# Altium schematic sheet 07_Analog Buffer.SchDoc
size A3; SheetNumber: 7; SheetTotal: 14
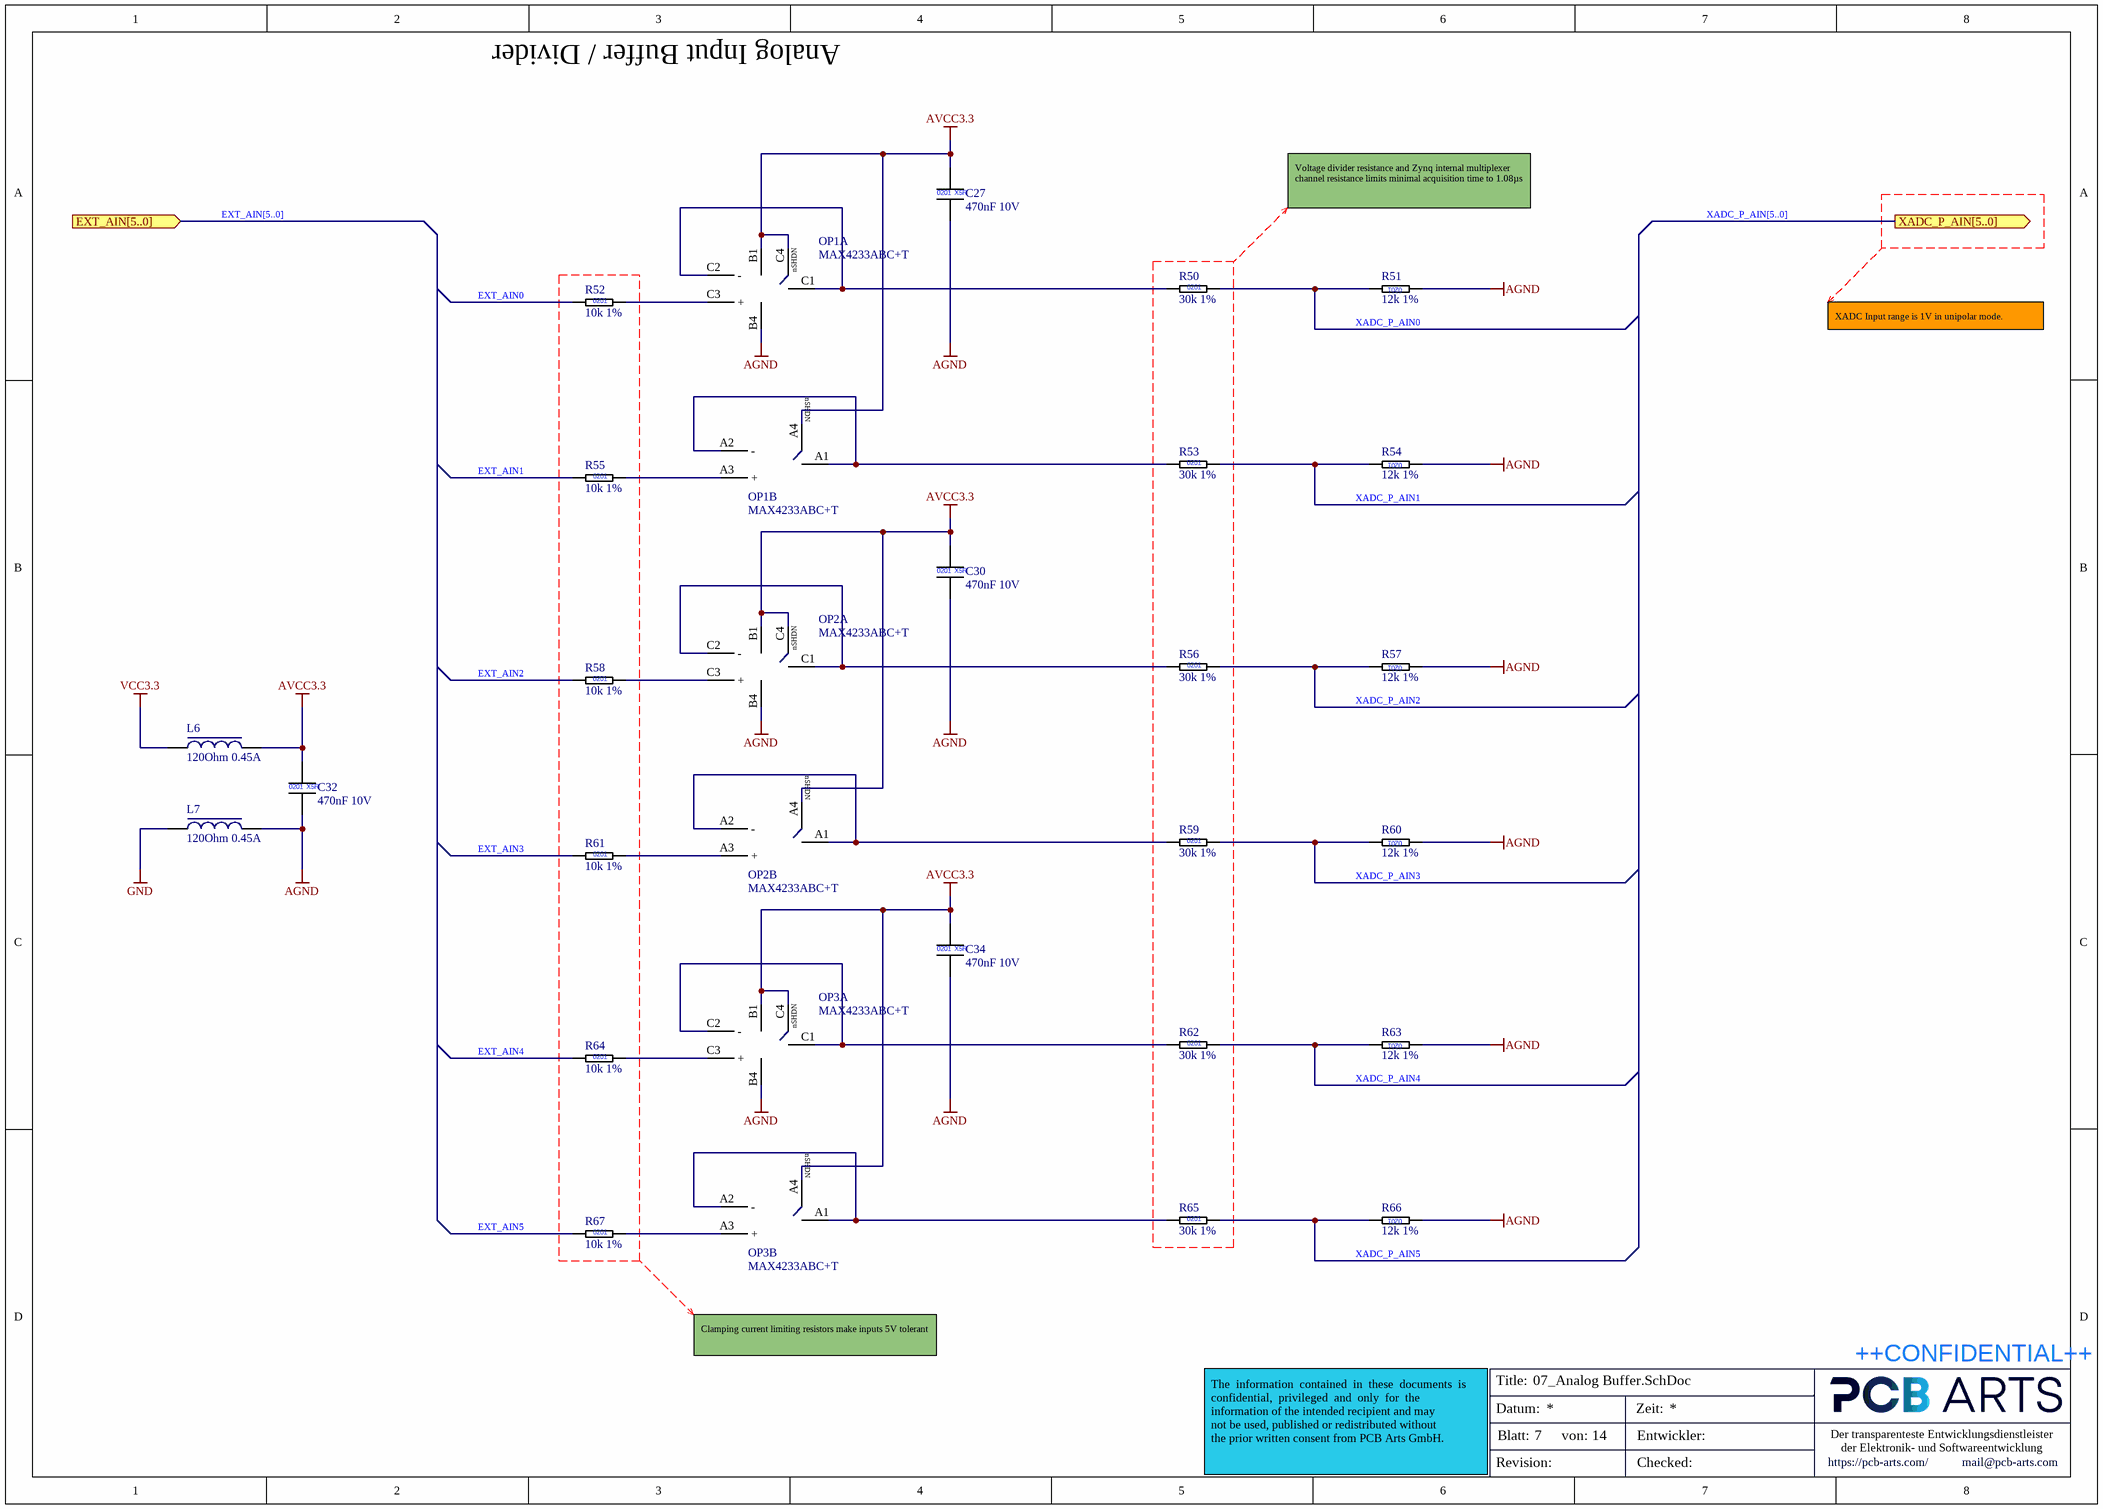
[diagram p0: 07_Analog Buffer.SchDoc]

## Parts
C27  470nF 10V  [CAPC0603X03L]
C30  470nF 10V  [CAPC0603X03L]
C32  470nF 10V  [CAPC0603X03L]
C34  470nF 10V  [CAPC0603X03L]
L6  120Ohm 0.45A  [INDC0603X03L]
L7  120Ohm 0.45A  [INDC0603X03L]
OP1  MAX4233ABC+T  [BGA10C50P4X3_202X154X69]  (parts A,B of 2)
OP2  MAX4233ABC+T  [BGA10C50P4X3_202X154X69]  (parts A,B of 2)
OP3  MAX4233ABC+T  [BGA10C50P4X3_202X154X69]  (parts A,B of 2)
R50  30k 1%  [RESC0603X03L]
R51  12k 1%  [RESC0603X03L]
R52  10k 1%  [RESC0603X03L]
R53  30k 1%  [RESC0603X03L]
R54  12k 1%  [RESC0603X03L]
R55  10k 1%  [RESC0603X03L]
R56  30k 1%  [RESC0603X03L]
R57  12k 1%  [RESC0603X03L]
R58  10k 1%  [RESC0603X03L]
R59  30k 1%  [RESC0603X03L]
R60  12k 1%  [RESC0603X03L]
R61  10k 1%  [RESC0603X03L]
R62  30k 1%  [RESC0603X03L]
R63  12k 1%  [RESC0603X03L]
R64  10k 1%  [RESC0603X03L]
R65  30k 1%  [RESC0603X03L]
R66  12k 1%  [RESC0603X03L]
R67  10k 1%  [RESC0603X03L]

## Ports
EXT_AIN[5..0] (in), XADC_P_AIN[5..0] (out)

## Nets
AGND: C27.2 C30.2 C32.2 C34.2 L7.2 OP1.B4(V-) OP2.B4(V-) OP3.B4(V-) R51.1 R54.1 R57.1 R60.1 R63.1 R66.1
AVCC3.3: C27.1 C30.1 C32.1 C34.1 L6.2 OP1.A4(~{SHDN}) OP1.B1(V+) OP1.C4(~{SHDN}) OP2.A4(~{SHDN}) OP2.B1(V+) OP2.C4(~{SHDN}) OP3.A4(~{SHDN}) OP3.B1(V+) OP3.C4(~{SHDN})
GND: L7.1
VCC3.3: L6.1
EXT_AIN0: R52.1
EXT_AIN1: R55.1
EXT_AIN2: R58.1
EXT_AIN3: R61.1
EXT_AIN4: R64.1
EXT_AIN5: R67.1
XADC_P_AIN0: R50.2 R51.2
XADC_P_AIN1: R53.2 R54.2
XADC_P_AIN2: R56.2 R57.2
XADC_P_AIN3: R59.2 R60.2
XADC_P_AIN4: R62.2 R63.2
XADC_P_AIN5: R65.2 R66.2
NetOP1_A1: OP1.A1(OUT_B) OP1.A2(-) R53.1
NetOP1_A3: OP1.A3(+) R55.2
NetOP1_C1: OP1.C1(OUT) OP1.C2(-) R50.1
NetOP1_C3: OP1.C3(+) R52.2
NetOP2_A1: OP2.A1(OUT_B) OP2.A2(-) R59.1
NetOP2_A3: OP2.A3(+) R61.2
NetOP2_C1: OP2.C1(OUT) OP2.C2(-) R56.1
NetOP2_C3: OP2.C3(+) R58.2
NetOP3_A1: OP3.A1(OUT_B) OP3.A2(-) R65.1
NetOP3_A3: OP3.A3(+) R67.2
NetOP3_C1: OP3.C1(OUT) OP3.C2(-) R62.1
NetOP3_C3: OP3.C3(+) R64.2

## Buses and harness runs
bus EXT_AIN[5..0] = port EXT_AIN[5..0]
bus XADC_P_AIN[5..0] = port XADC_P_AIN[5..0]

## Notes on the sheet
- Analog Input Buffer / Divider
- Voltage divider resistance and Zynq internal multiplexer channel resistance limits minimal acquisition time to 1.08µs
- XADC Input range is 1V in unipolar mode.
- Clamping current limiting resistors make inputs 5V tolerant
- Title:
- ++CONFIDENTIAL++
- Datum:
- Blatt:
- von:
- Zeit:
- Entwickler:
- Der transparenteste Entwicklungsdienstleister
  der Elektronik- und Softwareentwicklung
- The  information  contained  in  these  documents  is  confidential,  privileged  and  only  for  the
  information of the intended recipient and may
  not be used, published or redistributed without
  the prior written consent from PCB Arts GmbH.
- Revision:
- Checked:
- https://pcb-arts.com/
- mail@pcb-arts.com
- (in symbol CAP_0201_470nF_10V) 0201; X5R
- (in symbol MAX4233ABC+T_High-Output-Drive, 10MHz, 10V/μs,Rail-to-Rail I/O Op Amp, part A) nSHDN
- (in symbol MAX4233ABC+T_High-Output-Drive, 10MHz, 10V/μs,Rail-to-Rail I/O Op Amp, part B) nSHDN
- (in symbol RES_0201_10k_1%) 0201
- (in symbol RES_0201_12k_1%) 0201
- (in symbol RES_0201_30k_1%) 0201

## Library data of the parts
C27 C30 C32 C34 = CAP_0201_470nF_10V: Multilayer Ceramic Capacitors MLCC - SMD/SMT 0201 10VDC; Manufacturer 1: Taiyo Yuden; Manufacturer 1 Prt. Nr.: LMK063BBJ474KPLF; Manufacturer 2 Prt. Nr.: C0603X5R1A474M030BC; Manufacturer 2: TDK
L6 L7 = FLT_0201_120Ohm_0.45A: Ferrite Bead 0201 120Ohm 0.45A 25%; Manufacturer Prt. Nr.: BK0603HR121-T; Manufacturer: Taiyo Yuden
OP1-OP3 = MAX4233ABC+T_High-Output-Drive, 10MHz, 10V/μs,Rail-to-Rail I/O Op Amp: High-Output-Drive, 10MHz, 10V/μs,Rail-to-Rail I/O Op Amps with Shutdown; Manufacturer: Maxim Integrated; Manufacturer Prt. Nr.: MAX4233ABC+T
R50 R53 R56 R59 R62 R65 = RES_0201_30k_1%: Thick Film Resistors - SMD 30K OHM 1%; Manufacturer 1: Yageo; Manufacturer 1 Prt. Nr.: RC0201JR-0730KL; Manufacturer 2 Prt. Nr.: CRCW020130K0FNED; Manufacturer 2: Vishay / Dale
R51 R54 R57 R60 R63 R66 = RES_0201_12k_1%: Thick Film Resistors - SMD 12K OHM 1%; Manufacturer 1: Yageo; Manufacturer 1 Prt. Nr.: RC0201FR-0712KL; Manufacturer 2 Prt. Nr.: CRCW020112K0FKED; Manufacturer 2: Vishay / Dale
R52 R55 R58 R61 R64 R67 = RES_0201_10k_1%: Thick Film Resistors - SMD 10K OHM 1%; Manufacturer 1: Yageo; Manufacturer 1 Prt. Nr.: RC0201FR-0710KL; Manufacturer 2 Prt. Nr.: CRCW020110K0FNED; Manufacturer 2: Vishay / Dale